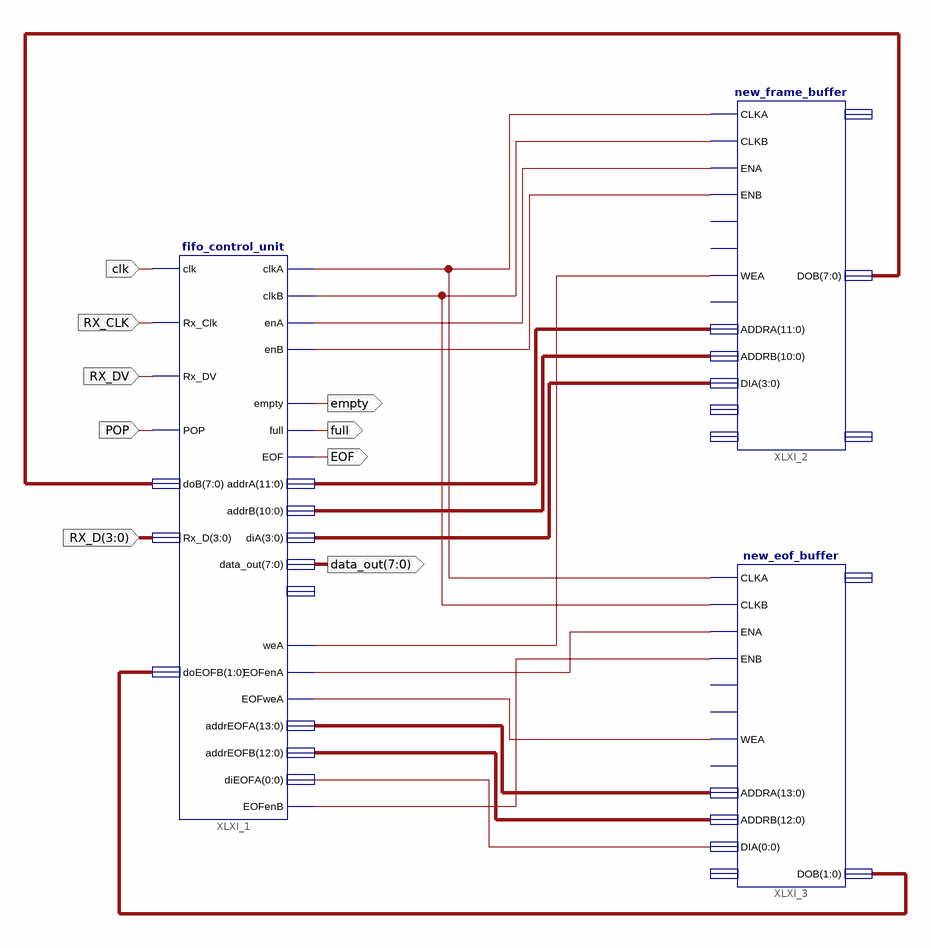
[diagram p0: schematic sheet 1]
// Xilinx ISE schematic ethernetRX.sch (spartan3e) as structural Verilog: 3 symbols, 9 ports
module ethernetRX (
  input  [3:0] RX_D,
  input  clk,
  input  RX_CLK,
  input  RX_DV,
  input  POP,
  output empty,
  output full,
  output EOF,
  output [7:0] data_out
);

  wire XLXN_4, XLXN_5, XLXN_9, XLXN_10, XLXN_11, XLXN_12, XLXN_13, XLXN_29;
  wire [0:0] XLXN_16;
  wire [1:0] XLXN_17;
  wire [3:0] XLXN_8;
  wire [7:0] XLXN_27;
  wire [10:0] XLXN_7;
  wire [11:0] XLXN_6;
  wire [12:0] XLXN_15;
  wire [13:0] XLXN_14;

  fifo_control_unit XLXI_1 (
    .clk(clk), .Rx_Clk(RX_CLK), .Rx_DV(RX_DV), .POP(POP), .doB(XLXN_27), .doEOFB(XLXN_17), .Rx_D(RX_D),
    .clkA(XLXN_10), .clkB(XLXN_11), .enA(XLXN_4), .enB(XLXN_5), .weA(XLXN_9), .EOFenA(XLXN_12),
    .EOFweA(XLXN_13), .EOFenB(XLXN_29), .empty(empty), .full(full), .EOF(EOF), .addrA(XLXN_6),
    .addrB(XLXN_7), .diA(XLXN_8), .addrEOFA(XLXN_14), .addrEOFB(XLXN_15), .diEOFA(XLXN_16[0]),
    .data_out(data_out));  // open: test
  new_frame_buffer XLXI_2 (
    .CLKA(XLXN_10), .CLKB(XLXN_11), .ENA(XLXN_4), .ENB(XLXN_5), .WEA(XLXN_9), .ADDRA(XLXN_6), .ADDRB(XLXN_7),
    .DIA(XLXN_8), .DOB(XLXN_27));  // open: SSRA, SSRB, WEB, DIB, DIPB, DOA, DOPB
  new_eof_buffer XLXI_3 (
    .CLKA(XLXN_10), .CLKB(XLXN_11), .ENA(XLXN_12), .ENB(XLXN_29), .WEA(XLXN_13), .ADDRA(XLXN_14),
    .ADDRB(XLXN_15), .DIA(XLXN_16[0]), .DOB(XLXN_17));  // open: SSRA, SSRB, WEB, DIB, DOA
endmodule
